# Altium schematic sheet root.SchDoc
size A4; SheetNumber: 1; SheetTotal: 5
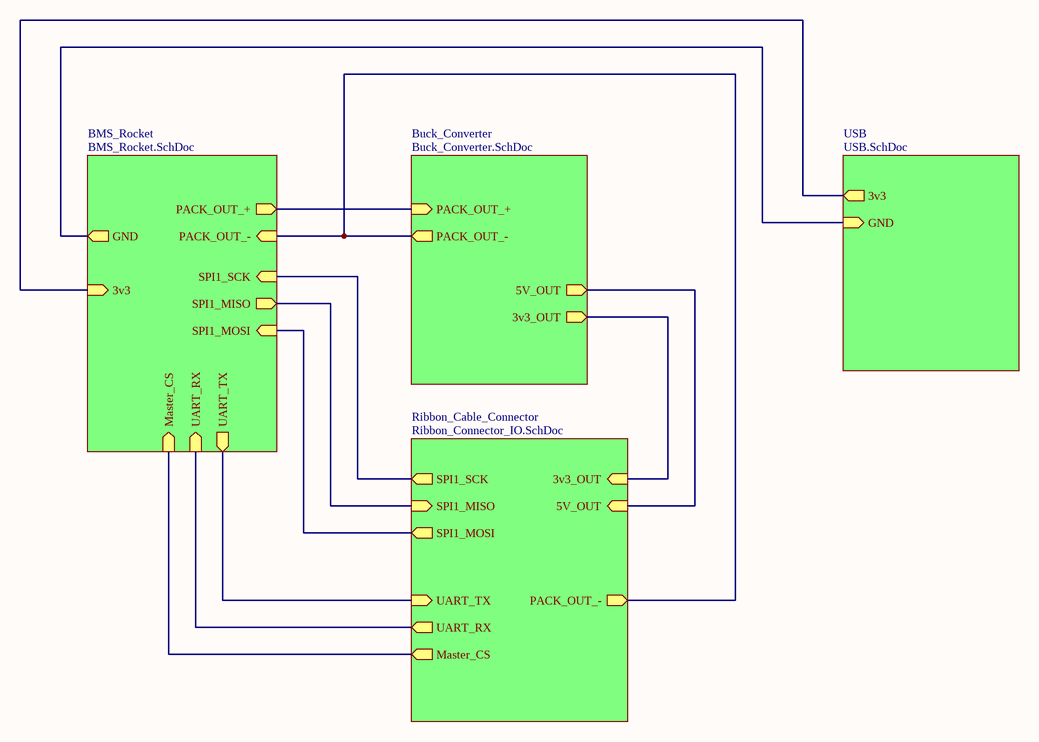
[diagram p0: root.SchDoc]

## Sub-sheets
BMS_Rocket = BMS_Rocket.SchDoc: PACK_OUT_+ (out), PACK_OUT_- (in), SPI1_SCK (in), SPI1_MISO (out), SPI1_MOSI (in), UART_RX (in), UART_TX (out), Master_CS (in), GND (out), 3v3 (in)
Buck_Converter = Buck_Converter.SchDoc: PACK_OUT_- (out), PACK_OUT_+ (in), 3v3_OUT (out), 5V_OUT (out)
Ribbon_Cable_Connector = Ribbon_Connector_IO.SchDoc: SPI1_SCK (out), SPI1_MISO (in), SPI1_MOSI (out), 3v3_OUT (in), 5V_OUT (in), UART_RX (out), UART_TX (in), PACK_OUT_- (out), Master_CS (out)
USB = USB.SchDoc: 3v3 (out), GND (in)

## Nets
(unnamed): sheet BMS_Rocket/PACK_OUT_+, sheet Buck_Converter/PACK_OUT_+
(unnamed): sheet BMS_Rocket/PACK_OUT_-, sheet Buck_Converter/PACK_OUT_-, sheet Ribbon_Cable_Connector/PACK_OUT_-
(unnamed): sheet BMS_Rocket/SPI1_SCK, sheet Ribbon_Cable_Connector/SPI1_SCK
(unnamed): sheet BMS_Rocket/SPI1_MISO, sheet Ribbon_Cable_Connector/SPI1_MISO
(unnamed): sheet BMS_Rocket/SPI1_MOSI, sheet Ribbon_Cable_Connector/SPI1_MOSI
(unnamed): sheet BMS_Rocket/UART_RX, sheet Ribbon_Cable_Connector/UART_RX
(unnamed): sheet BMS_Rocket/UART_TX, sheet Ribbon_Cable_Connector/UART_TX
(unnamed): sheet BMS_Rocket/Master_CS, sheet Ribbon_Cable_Connector/Master_CS
(unnamed): sheet BMS_Rocket/GND, sheet USB/GND
(unnamed): sheet BMS_Rocket/3v3, sheet USB/3v3
(unnamed): sheet Buck_Converter/3v3_OUT, sheet Ribbon_Cable_Connector/3v3_OUT
(unnamed): sheet Buck_Converter/5V_OUT, sheet Ribbon_Cable_Connector/5V_OUT